# EAGLE design Driver Message Board (EAGLE 9.6.2)
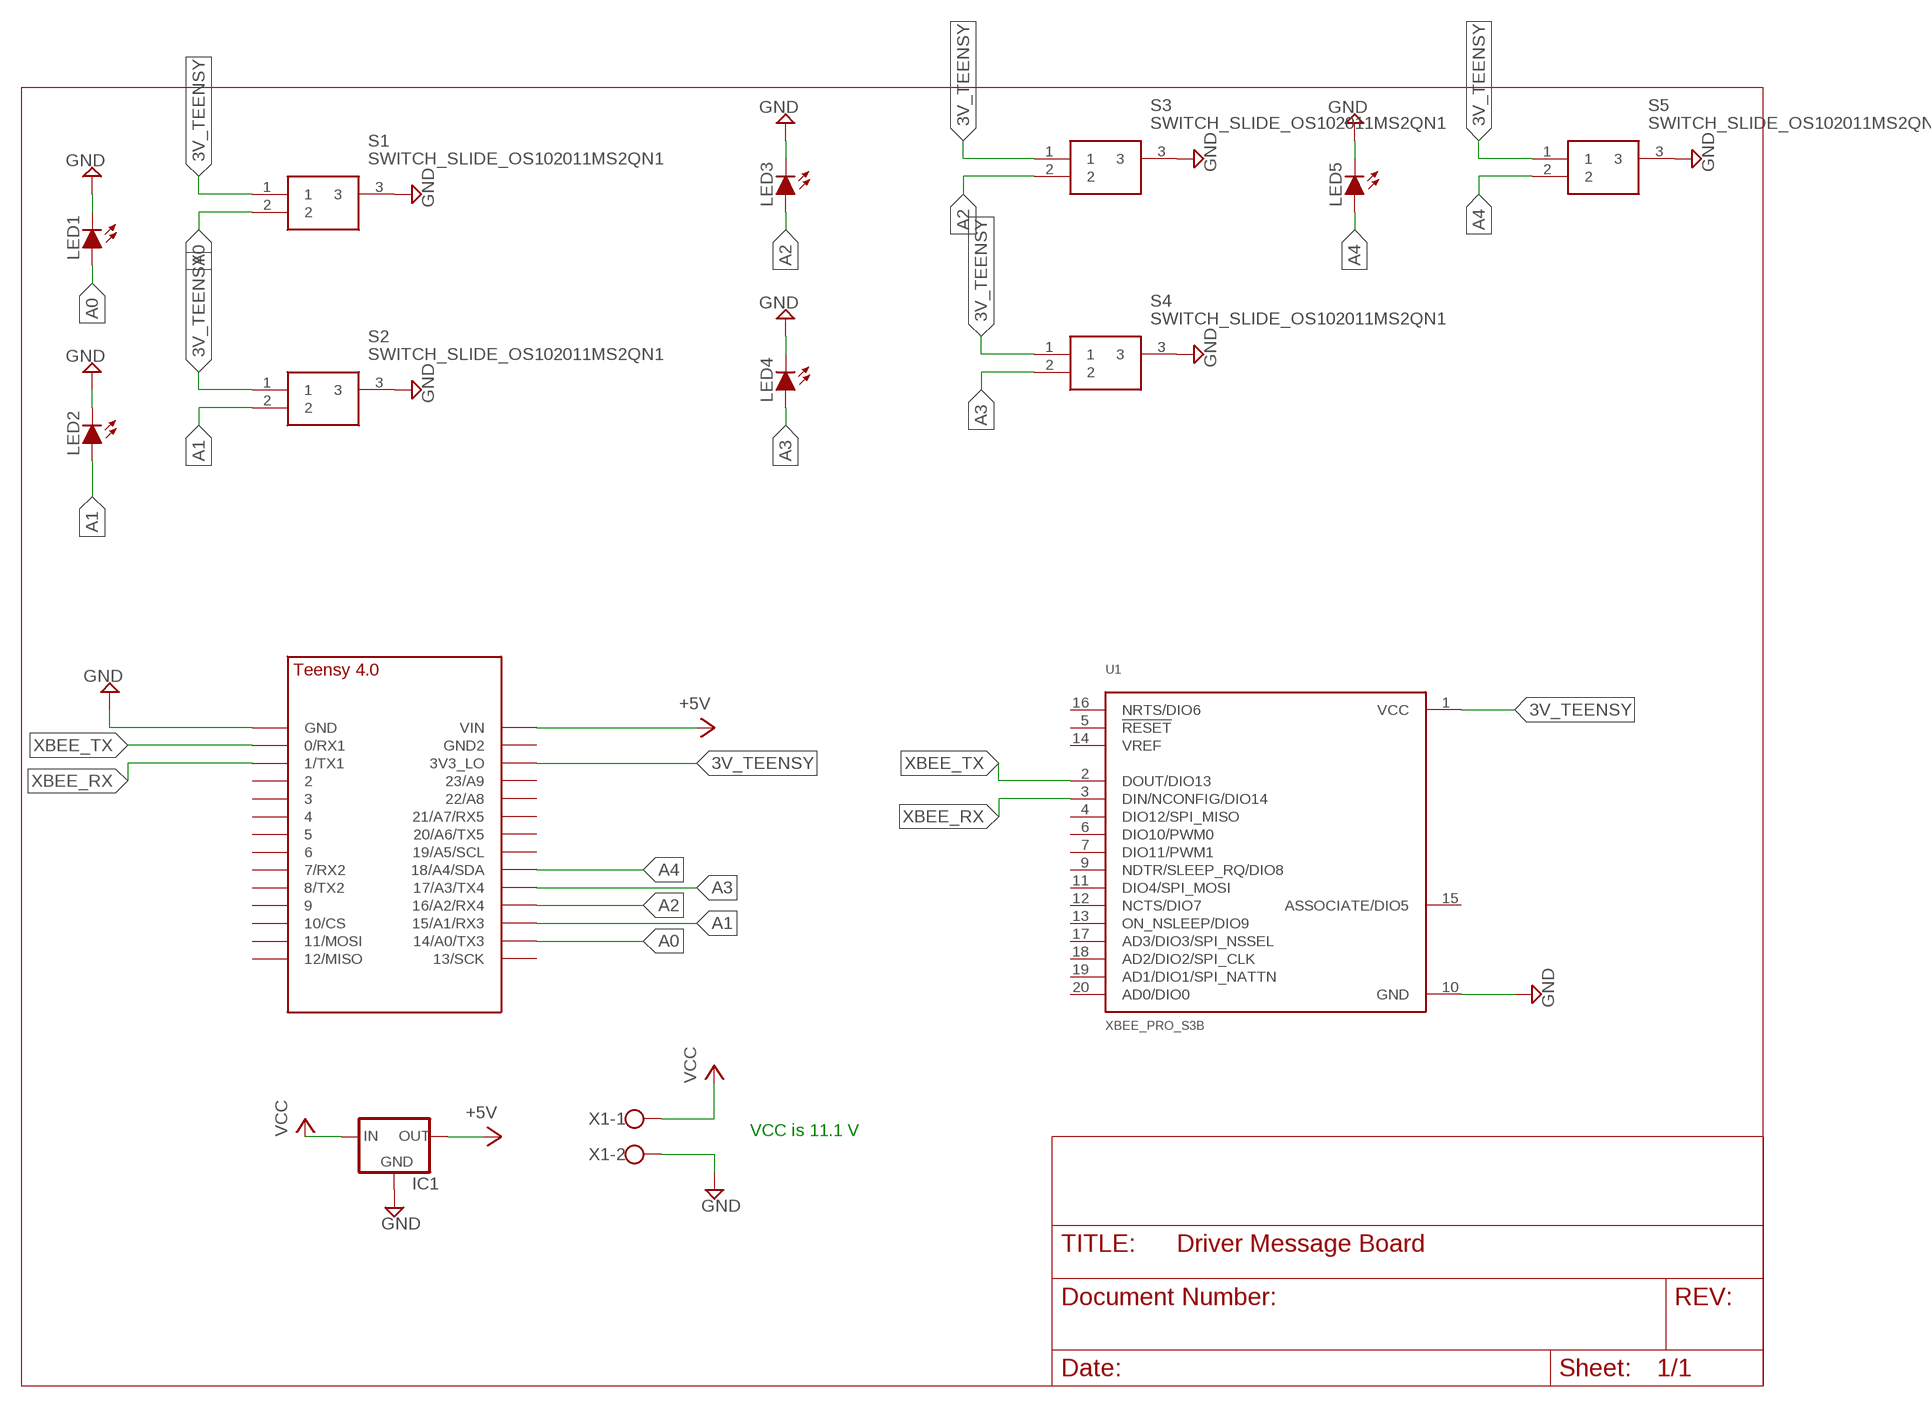
[diagram p0: schematic, sheet 1]

## Parts
IC1  REG_5V_L7805_HOR_HOLE  [TO-220-H-HOLE]
LED1  LED-5MM  [LED-5MM]
LED2  LED-5MM  [LED-5MM]
LED3  LED-5MM  [LED-5MM]
LED4  LED-5MM  [LED-5MM]
LED5  LED-5MM  [LED-5MM]
S1  SWITCH_SLIDE_OS102011MS2QN1  [OS102011MA1QN1]
S2  SWITCH_SLIDE_OS102011MS2QN1  [OS102011MA1QN1]
S3  SWITCH_SLIDE_OS102011MS2QN1  [OS102011MA1QN1]
S4  SWITCH_SLIDE_OS102011MS2QN1  [OS102011MA1QN1]
S5  SWITCH_SLIDE_OS102011MS2QN1  [OS102011MA1QN1]
U1  XBEE_PRO_S3B  [XBEE_PRO_S3B]
U$1  TEENSY_4.0_SIMPLE  [TEENSY_4.0_SIMPLE]
X1  W237-102  [W237-102]

## Nets
3V_TEENSY: S1.1 S2.1 S3.1 S4.1 S5.1 U1.1(VCC) U$1.3V3_LO
+5V: IC1.3(OUT) U$1.VIN
A0: LED1.A S1.2 U$1.14/A0(14/A0/TX3)
A1: LED2.A S2.2 U$1.15/A1(15/A1/RX3)
A2: LED3.A S3.2 U$1.16/A2(16/A2/RX4)
A3: LED4.A S4.2 U$1.17/A3(17/A3/TX4)
A4: LED5.A S5.2 U$1.18/A4/SDA
GND: IC1.2(GND) LED1.K(C) LED2.K(C) LED3.K(C) LED4.K(C) LED5.K(C) S1.3 S2.3 S3.3 S4.3 S5.3 U1.10(GND) U$1.GND X1.2
VCC: IC1.1(IN) X1.1
XBEE_RX: U1.3(DIN/NCONFIG/DIO14) U$1.1/TX(1/TX1)
XBEE_TX: U1.2(DOUT/DIO13) U$1.0/RX(0/RX1)
Unconnected: U1.4(DIO12/SPI_MISO) U1.5(!RESET) U1.6(DIO10/PWM0) U1.7(DIO11/PWM1) U1.9(NDTR/SLEEP_RQ/DIO8) U1.11(DIO4/SPI_MOSI) U1.12(NCTS/DIO7) U1.13(ON_NSLEEP/DIO9) U1.14(VREF) U1.15(ASSOCIATE/DIO5) U1.16(NRTS/DIO6) U1.17(AD3/DIO3/SPI_NSSEL) U1.18(AD2/DIO2/SPI_CLK) U1.19(AD1/DIO1/SPI_NATTN) U1.20(AD0/DIO0) U$1.2 U$1.3/CANTX U$1.4/CANRX U$1.5 U$1.6 U$1.7(7/RX2) U$1.8(8/TX2) U$1.9/CS U$1.10/CS U$1.11/MOSI U$1.12/MISO U$1.13/SCK U$1.19/A5/SCL U$1.20/A6(20/A6/TX5) U$1.21/A7(21/A7/RX5) U$1.22/A8 U$1.23/A9 U$1.GND2

## Notes on the sheet
- VCC is 11.1 V

## Library data of the parts
IC1 = GTOR - Active Components:REG_5V_L7805: Voltage Regulator Switching 5v regulator Datasheet <http://power.murata.com/data/power/oki-78sr.pdf> Standard 7805 5V regulator. IGO (Input Ground Output). Spark Fun Electronics SKU : COM-00107 Datasheet <http://www.mouser.com/ds/2/308/MC7800-D-94905.pdf>
LED1-LED5 = GTOR - Passive Components:LED: Light Emitting Diode (LED) Source: Dangerous Prototypes Eagle Library <https://github.com/DangerousPrototypes/Eagle_Part_Library>
S1-S5 = GTOR - Active Components:SWITCH_SLIDE_OS102011MS2QN1: Switch Slide Miniature SPDT 0.1A 12VDC Through Hole Slide Switch SPDT On-On 0.1 A@ 12 V dc Slide Source: Datasheet <http://www.ckswitches.com/media/1428/os.pdf>; ARROW_PART_NUMBER: OS102011MS2QN1; ARROW_PRICE-STOCK: https://www.arrow.com/en/products/os102011ms2qn1/ck; DESCRIPTION: Switch Slide Miniature SPDT 0.1A 12VDC Through Hole Slide Switch SPDT On-On 0.1 A@ 12 V dc Slide; HEIGHT: mm; MANUFACTURER_NAME: C & K COMPONENTS; MANUFACTURER_PART_NUMBER: OS102011MS2QN1; MOUSER_PART_NUMBER: 611-OS102011MS2QN1; MOUSER_PRICE-STOCK: https://www.mouser.co.uk/ProductDetail/CK/OS102011MS2QN1?qs=WtljUlYws5RvQ1hEv876nQ%3D%3D
U1 = GTOR - Microcontroller:XBEE_PRO_S3B: XBee-PRO 900HP DigiMesh 900 MHz 200 Kbps RF Module with U.FL Connector; DESCRIPTION: General ISM < 1GHz Transceiver Module 900MHz Antenna Not Included, RP-SMA Through Hole; DIGI-KEY_PART_NUMBER: 602-1293-ND; MF: Digi International; MP: XBP9B-XCST-001; PACKAGE: Module Digi International
U$1 = GTOR - Microcontroller:TEENSY_4.0_SIMPLE
X1 = con-wago-500:W237-102: WAGO SCREW CLAMP; MPN: 237-102; OC_FARNELL: unknown; OC_NEWARK: 70K9898

## Board
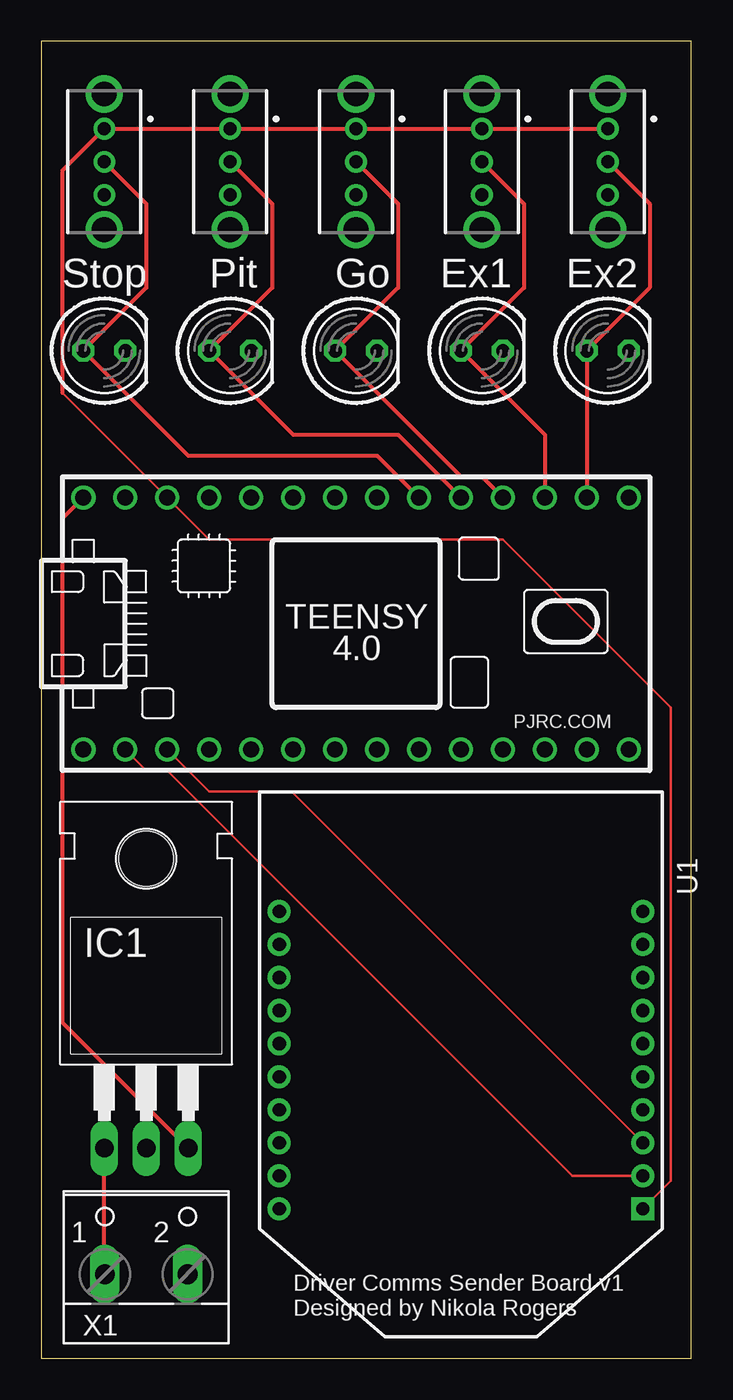
[diagram p1: board, top side]
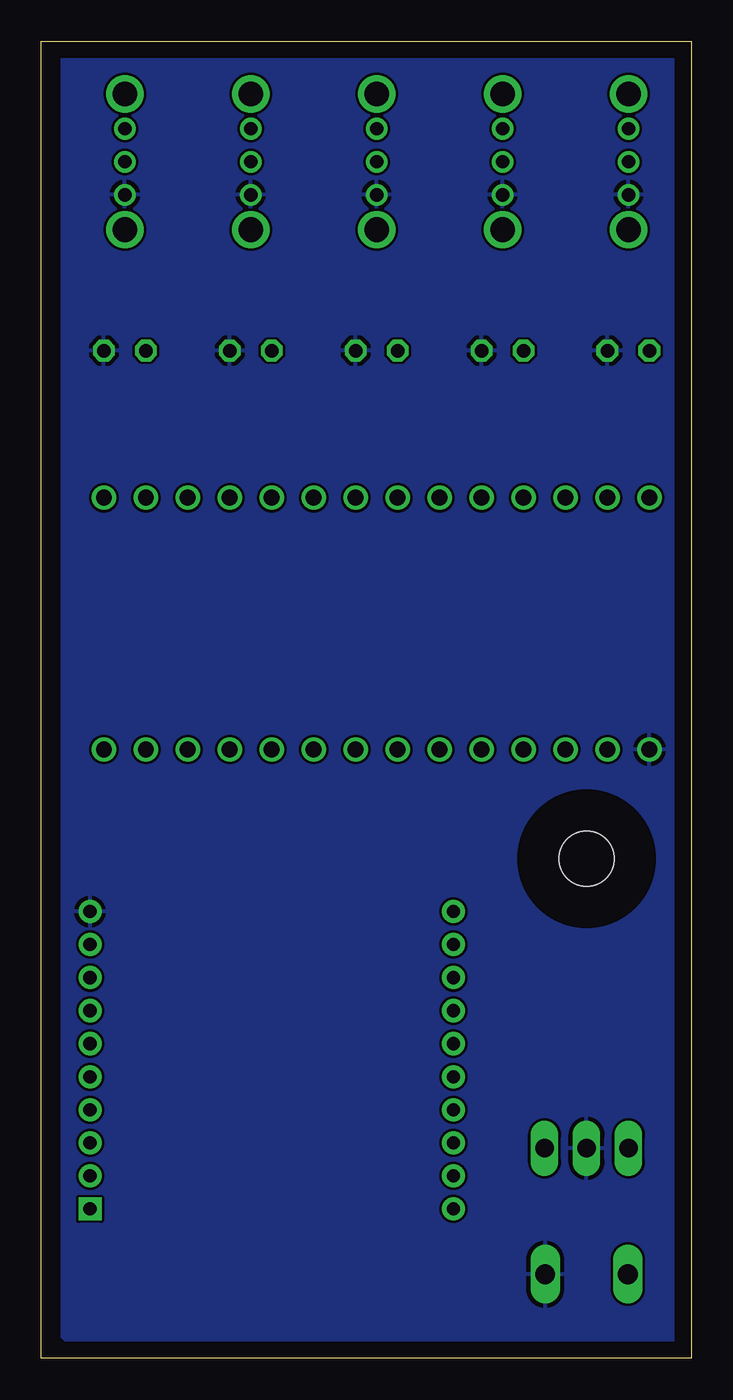
[diagram p2: board, bottom side, seen from below]

Size 39.35 x 79.68 mm. Coordinates in mm from the lower left corner, seen from the top.
Outline: 0,0 39.35,0 39.35,79.68 0,79.68 0,0
Copper layers (1*16): Top 0.035mm / dielectric 1.5mm / Bottom 0.035mm
Design rules "default": minimum track width 6mil, minimum drill 0.35mm, track to track 6mil, track to pad 6mil, pad to pad 6mil, via to via 6mil, smd to smd 6mil, copper to edge 40mil, drill to drill 6mil, minimum pad ring 10mil, minimum via ring 8mil, stop-mask expansion 4mil, vias tented up to drill 0mil, thermal gap 10mil

### Footprints (pad centres in the part's own frame; a part is rotated, then mirrored left to right if it is on the bottom)
TO-220-H-HOLE = drill 1.118 long: 1 -2.54,-6.35; 2 0,-6.35; 3 2.54,-6.35 | hole 3.302: 0,11.176
LED-5MM = drill 0.813 octagon: A -1.27,0; K 1.27,0
OS102011MA1QN1 = drill 0.8 pad 1.3: 1 -2,0; 2 0,0; 3 2,0 | drill 1.5 pad 2.25: 4 -4.1,0; 5 4.1,0
XBEE_PRO_S3B = drill 0.8 pad 1.4 square: 1 -11,8.75 | drill 0.8 pad 1.4: 2 -11,6.75; 3 -11,4.75; 4 -11,2.75; 5 -11,0.75; 6 -11,-1.25; 7 -11,-3.25; 8 -11,-5.25; 9 -11,-7.25; 10 -11,-9.25; 11 11,-9.25; 12 11,-7.25; 13 11,-5.25; 14 11,-3.25; 15 11,-1.25; 16 11,0.75; 17 11,2.75; 18 11,4.75; 19 11,6.75; 20 11,8.75
TEENSY_4.0_SIMPLE = drill 0.965: 0/RX -13.97,-7.62; 1/TX -11.43,-7.62; 2 -8.89,-7.62; 3/CANTX -6.35,-7.62; 3V3_LO -11.43,7.62; 4/CANRX -3.81,-7.62; 5 -1.27,-7.62; 6 1.27,-7.62; 7 3.81,-7.62; 8 6.35,-7.62; 9/CS 8.89,-7.62; 10/CS 11.43,-7.62; 11/MOSI 13.97,-7.62; 12/MISO 16.51,-7.62; 13/SCK 16.51,7.62; 14/A0 13.97,7.62; 15/A1 11.43,7.62; 16/A2 8.89,7.62; 17/A3 6.35,7.62; 18/A4/SDA 3.81,7.62; 19/A5/SCL 1.27,7.62; 20/A6 -1.27,7.62; 21/A7 -3.81,7.62; 22/A8 -6.35,7.62; 23/A9 -8.89,7.62; GND -16.51,-7.62; GND2 -13.97,7.62; VIN -16.51,7.62
W237-102 = drill 1.194 long: 1 -2.5,-1.27; 2 2.5,-1.27

### Placement (x,y rotation side)
IC1  6.35,19.05 0 top
LED1  34.29,60.96 0 top
LED2  26.67,60.96 0 top
LED3  19.05,60.96 0 top
LED4  11.43,60.96 0 top
LED5  3.81,60.96 0 top
S1  34.29,72.39 270 top
S2  26.67,72.39 270 top
S3  19.05,72.39 270 top
S4  11.43,72.39 270 top
S5  3.81,72.39 270 top
U1  25.4,17.78 180 top
U$1  19.05,44.45 0 top
X1  6.35,6.35 0 top

### Tracks (layer width: path | path; a pad name or v marks a point on that pad's centre or on a via)
3V_TEENSY
  Top 0.152: U1.1 38.1,10.73 38.1,39.37 27.94,49.53 10.16,49.53 U$1.3V3_LO 1.27,58.42
  Top 0.254: 1.27,58.42 1.27,71.85 S5.1 S4.1 S3.1 S2.1 S1.1
+5V
  Top 0.254: U$1.VIN 1.27,50.8 1.27,20.32 IC1.3
A0
  Top 0.254: S1.2 36.83,69.85 36.83,64.77 LED1.A U$1.14/A0
A1
  Top 0.254: S2.2 29.21,69.85 29.21,64.77 LED2.A 30.48,55.88 U$1.15/A1
A2
  Top 0.254: S3.2 21.59,69.85 21.59,64.77 LED3.A 25.4,53.34 26.67,53.34 U$1.16/A2
A3
  Top 0.254: S4.2 13.97,69.85 13.97,64.77 LED4.A 15.24,55.88 21.59,55.88 U$1.17/A3
A4
  Top 0.254: S5.2 6.35,69.85 6.35,64.77 LED5.A 8.89,54.61 20.32,54.61 U$1.18/A4/SDA
GND
  pour Bottom: 0,80.01 36.83,80.01 38.1,78.74 38.1,1.27 36.83,0 0,0
VCC
  Top 0.152: X1.1 3.81,5.12
  Top 0.254: 3.81,5.12 IC1.1
XBEE_RX
  Top 0.152: U1.3 15.14,34.29 10.16,34.29 U$1.1/TX
XBEE_TX
  Top 0.152: U1.2 32.15,11.03 7.62,35.56 6.35,35.56 U$1.0/RX

### Text on the board
tNames: Stop | Pit | Go | Ex1 | Ex2 | Driver Comms Sender Board v1 / Designed by Nikola Rogers